# Altium schematic sheet Mode Switch.SchDoc
size 297 x 209 mm; SheetNumber: 15; SheetTotal: 29
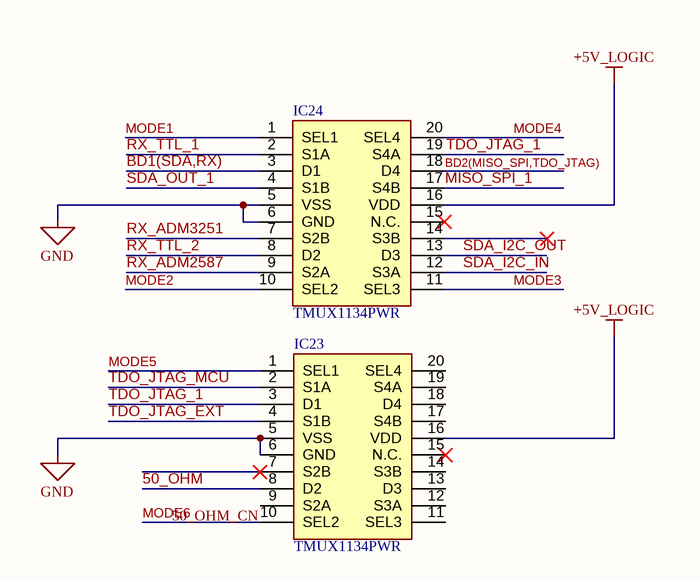
[diagram p0: Mode Switch.SchDoc]

## Parts
IC23  TMUX1134PWR  [SOP65P640X120-20N]
IC24  TMUX1134PWR  [SOP65P640X120-20N]

## Nets
+5V_LOGIC: IC23.16(VDD) IC24.16(VDD)
GND: IC23.5(VSS) IC23.6(GND) IC24.5(VSS) IC24.6(GND)
50_OHM: IC23.8(D2)
50_OHM_CN: IC23.9(S2A)
BD1(SDA,RX): IC24.3(D1)
BD2(MISO_SPI,TDO_JTAG): IC24.18(D4)
MISO_SPI_1: IC24.17(S4B)
MODE1: IC24.1(SEL1)
MODE2: IC24.10(SEL2)
MODE3: IC24.11(SEL3)
MODE4: IC24.20(SEL4)
MODE5: IC23.1(SEL1)
MODE6: IC23.10(SEL2)
RX_ADM2587: IC24.9(S2A)
RX_ADM3251: IC24.7(S2B)
RX_TTL_1: IC24.2(S1A)
RX_TTL_2: IC24.8(D2)
SDA_I2C_IN: IC24.12(S3A)
SDA_I2C_OUT: IC24.13(D3)
SDA_OUT_1: IC24.4(S1B)
TDO_JTAG_1: IC23.3(D1) IC24.19(S4A)
TDO_JTAG_EXT: IC23.4(S1B)
TDO_JTAG_MCU: IC23.2(S1A)

Not connected (* = marked no-connect by the designer): IC23 7(S2B)* 11(SEL3) 12(S3A) 13(D3) 14(S3B) 15(N.C.)* 17(S4B) 18(D4) 19(S4A) 20(SEL4); IC24 14(S3B)* 15(N.C.)*

## Notes on the sheet
- Drawn
- Name
- Date
- Drawing Title
- Checked
- Drawing No.
- Approved
- Size
- A4
- Ver.
- Rev.
- Sheet
- Of

## Library data of the parts
IC23 IC24 = TMUX1134PWR: Integrated Circuit; Manufacturer_Name: Texas Instruments; Datasheet Link: https://www.ti.com/lit/gpn/TMUX1134; Height: 1.2mm; Manufacturer_Part_Number: TMUX1134PWR; Mouser Part Number: 595-TMUX1134PWR; Mouser Price/Stock: https://www.mouser.co.uk/ProductDetail/Texas-Instruments/TMUX1134PWR?qs=%252B6g0mu59x7L8VGQncKsYmQ%3D%3D; Arrow Part Number: TMUX1134PWR; Arrow Price/Stock: null?region=nac